# Altium schematic sheet BRZ_PDU.SchDoc
size C; SheetNumber: 1; SheetTotal: 5
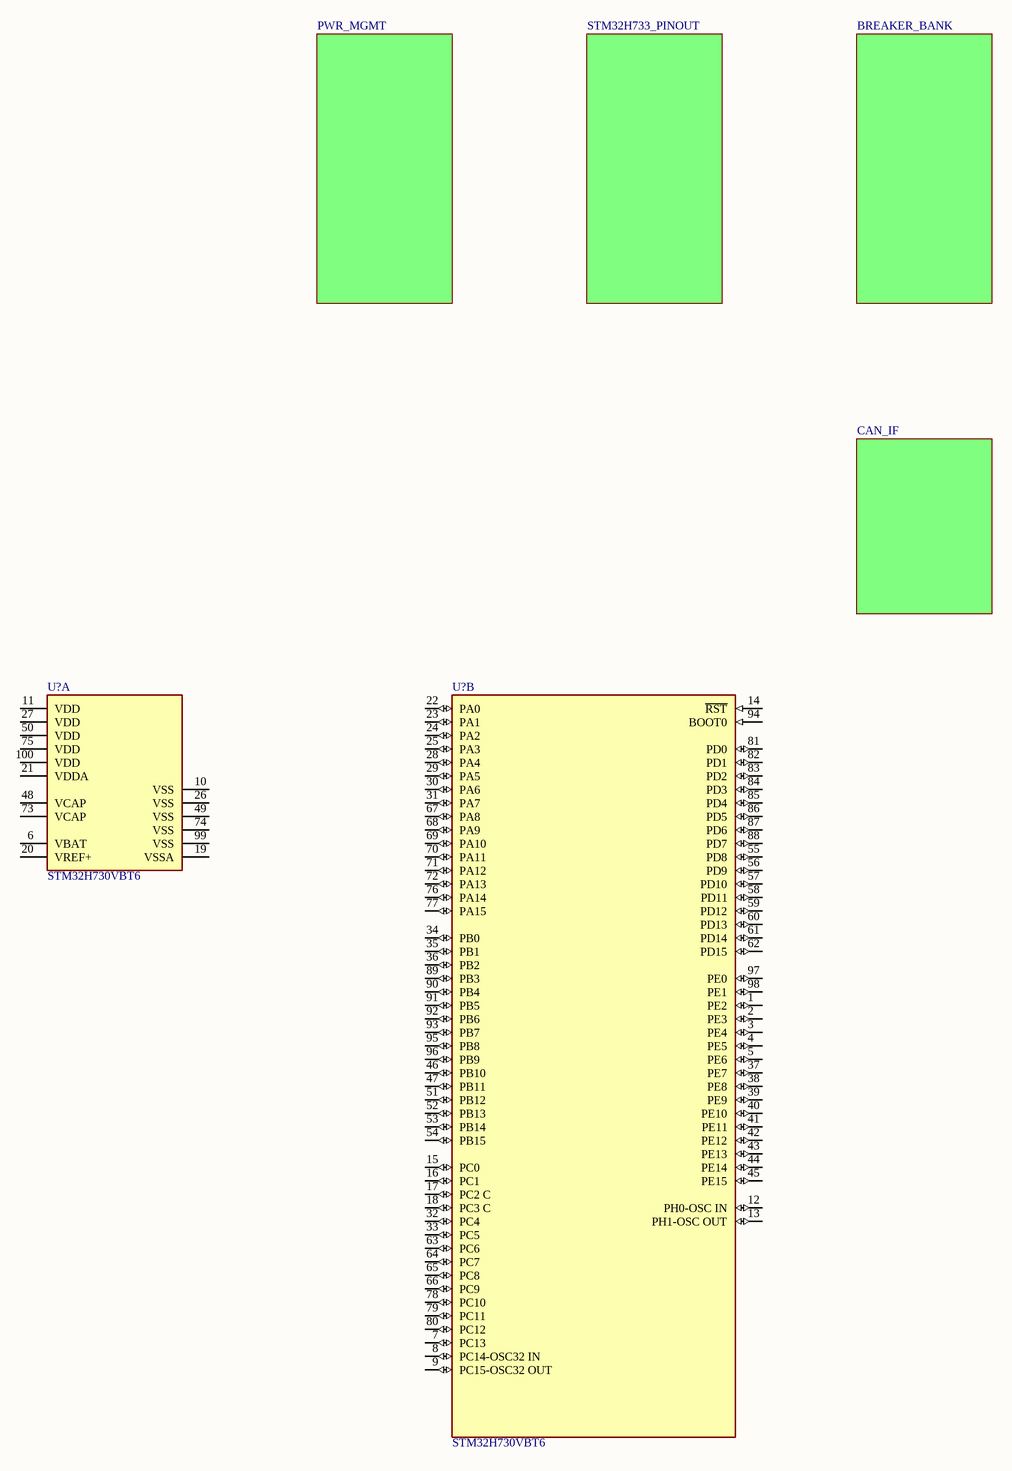
[diagram p0: BRZ_PDU.SchDoc]

## Parts
(Parts that share a designator on the sheet are numbered #1, #2 ... from top to bottom, then left to right.)
U?#1  STM32H730VBT6  [FP-LQFP100-1L-IPC_C]  (part A of 2)
U?#2  STM32H730VBT6  [FP-LQFP100-1L-IPC_C]  (part B of 2)

## Sub-sheets
BREAKER_BANK_0 = BREAKER_BANK: no entries
CAN_0 = CAN_IF: no entries
MCU = STM32H733_PINOUT: no entries
PWR_MGMT = PWR_MGMT: no entries

## Nets

Not connected (* = marked no-connect by the designer): U?#1 6(VBAT) 10(VSS) 11(VDD) 19(VSSA) 20(VREF+) 21(VDDA) 26(VSS) 27(VDD) 48(VCAP) 49(VSS) 50(VDD) 73(VCAP) 74(VSS) 75(VDD) 99(VSS) 100(VDD); U?#2 1(PE2) 2(PE3) 3(PE4) 4(PE5) 5(PE6) 7(PC13) 8(PC14-OSC32_IN) 9(PC15-OSC32_OUT) 12(PH0-OSC_IN) 13(PH1-OSC_OUT) 14(~{RST}) 15(PC0) 16(PC1) 17(PC2_C) 18(PC3_C) 22(PA0) 23(PA1) 24(PA2) 25(PA3) 28(PA4) 29(PA5) 30(PA6) 31(PA7) 32(PC4) 33(PC5) 34(PB0) 35(PB1) 36(PB2) 37(PE7) 38(PE8) 39(PE9) 40(PE10) 41(PE11) 42(PE12) 43(PE13) 44(PE14) 45(PE15) 46(PB10) 47(PB11) 51(PB12) 52(PB13) 53(PB14) 54(PB15) 55(PD8) 56(PD9) 57(PD10) 58(PD11) 59(PD12) 60(PD13) 61(PD14) 62(PD15) 63(PC6) 64(PC7) 65(PC8) 66(PC9) 67(PA8) 68(PA9) 69(PA10) 70(PA11) 71(PA12) 72(PA13) 76(PA14) 77(PA15) 78(PC10) 79(PC11) 80(PC12) 81(PD0) 82(PD1) 83(PD2) 84(PD3) 85(PD4) 86(PD5) 87(PD6) 88(PD7) 89(PB3) 90(PB4) 91(PB5) 92(PB6) 93(PB7) 94(BOOT0) 95(PB8) 96(PB9) 97(PE0) 98(PE1)

## Library data of the parts
U?#1 U?#2 = CMP-12105-000107-1: IC MCU 32BIT 128KB FLASH 100LQFP